# Altium project Kapitoshka.PrjPcb
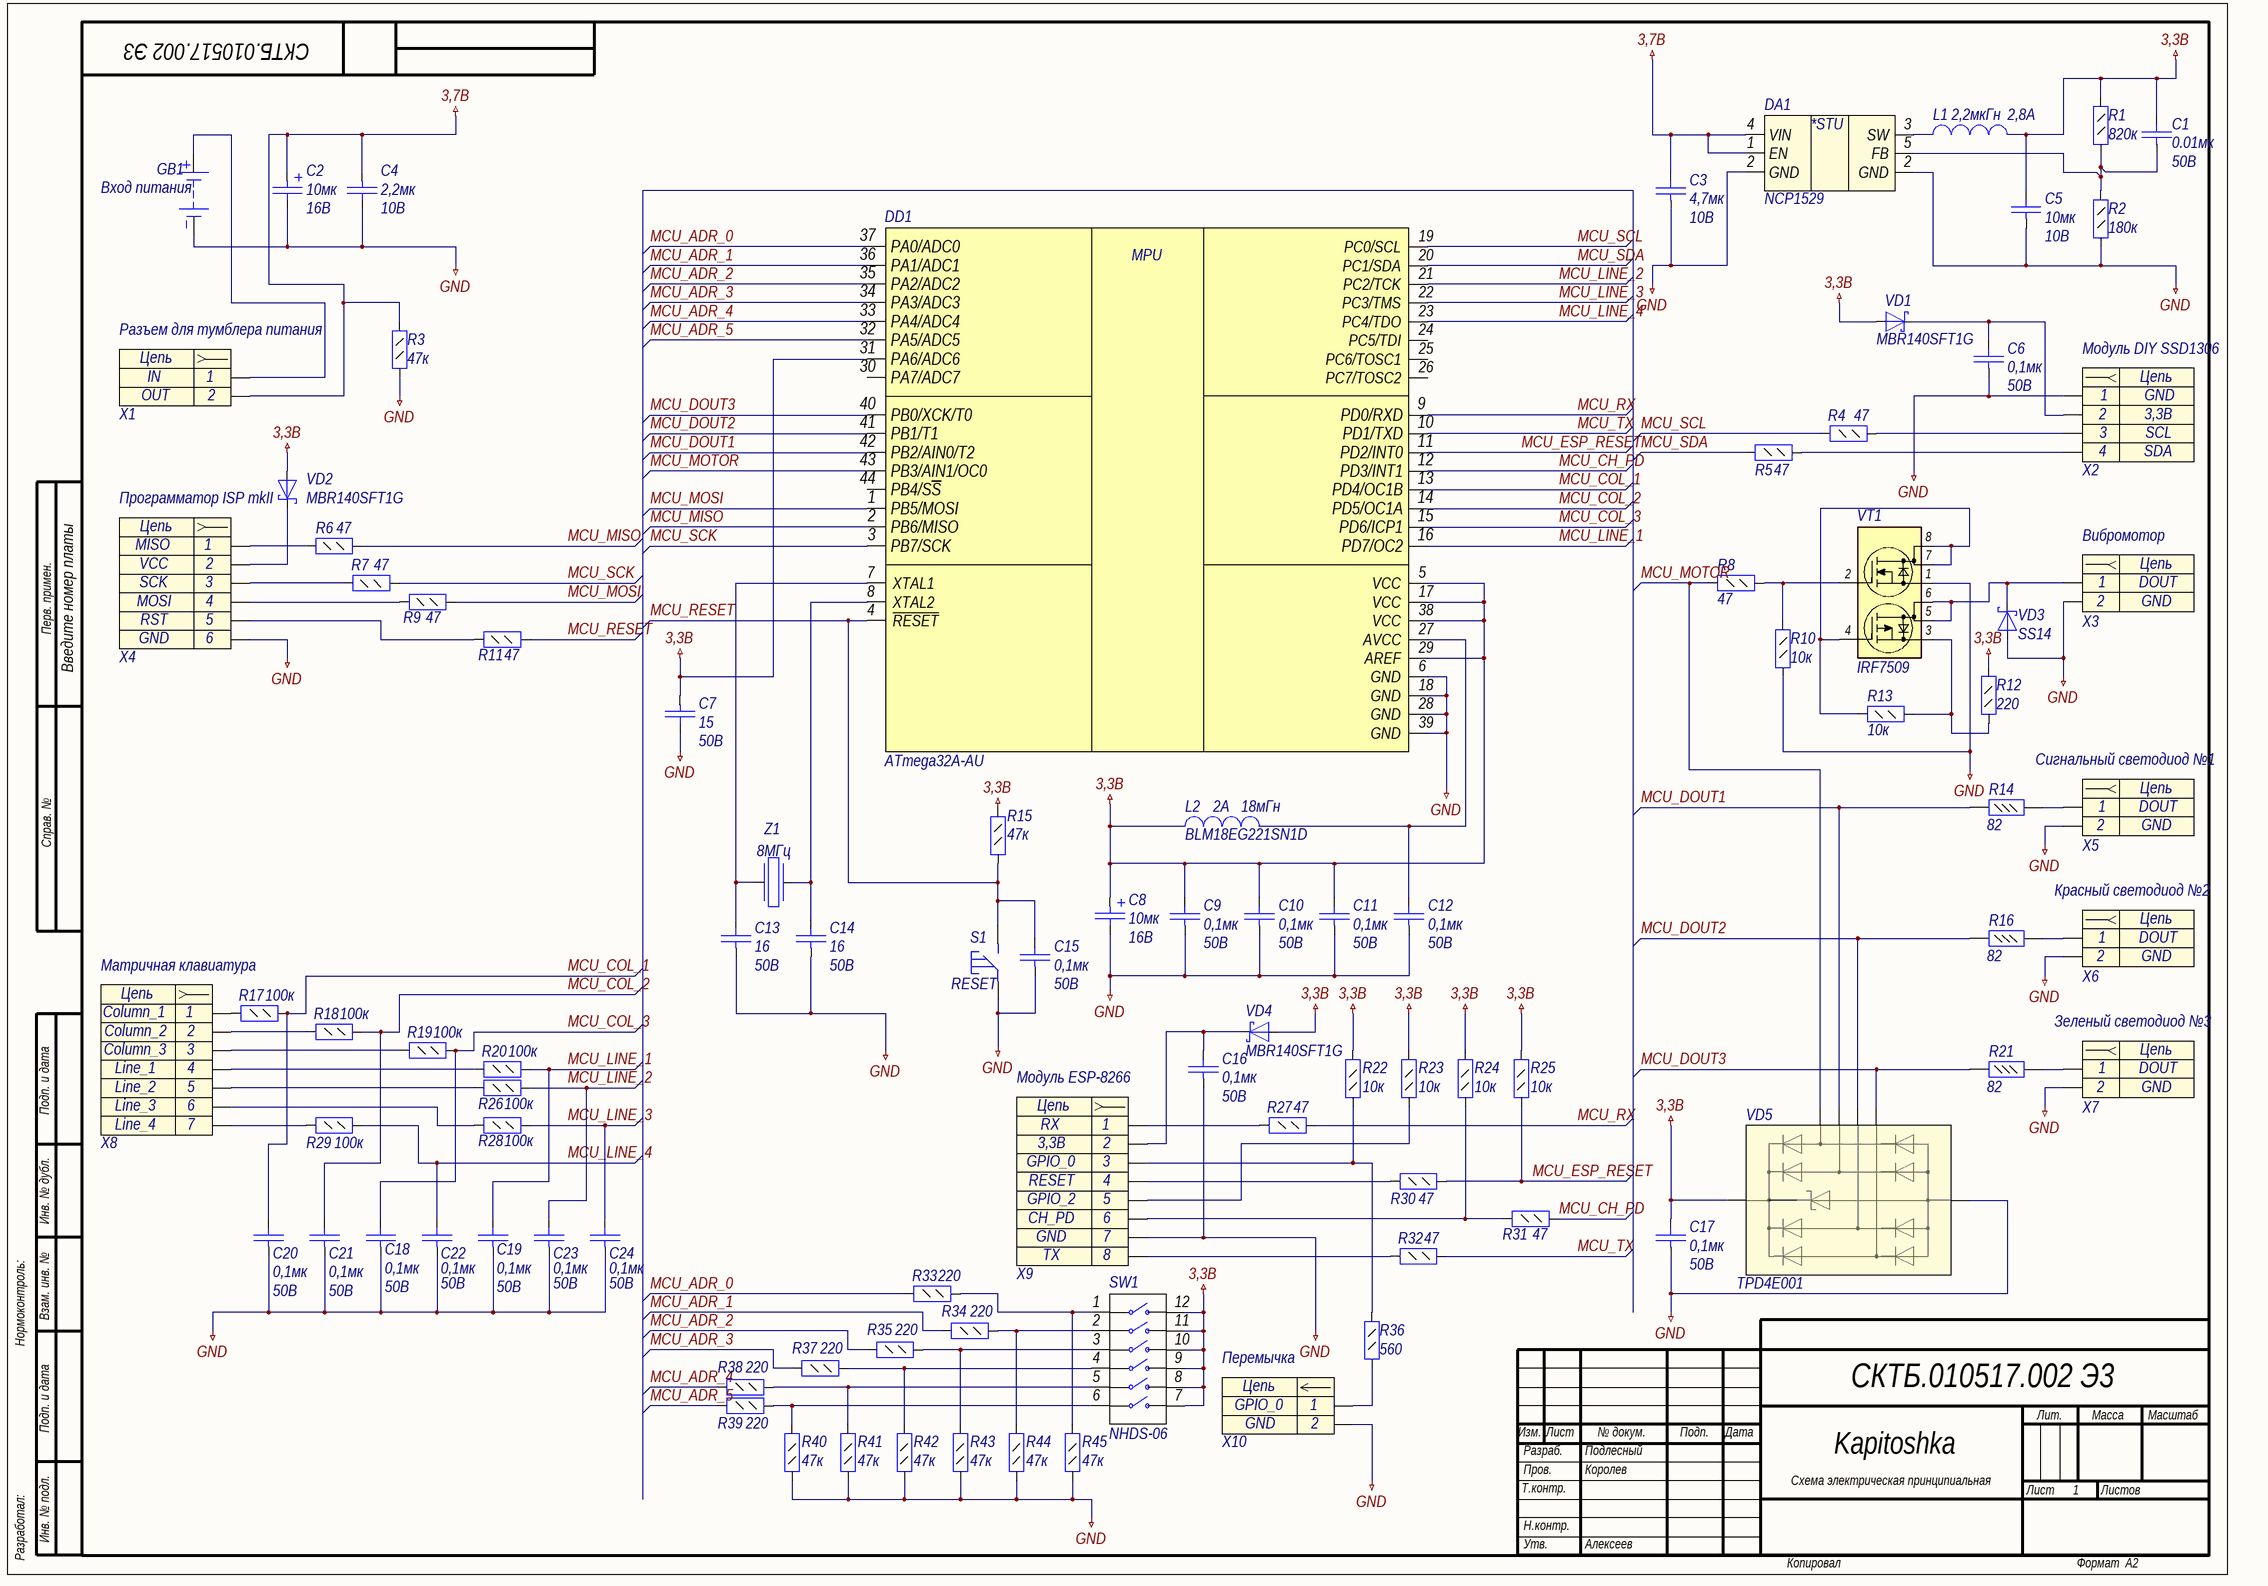
[diagram p0: Kapitoshka.SchDoc]
1 sheet, 93 parts. Net scope: global (net labels, ports and power ports of the same name join across sheets).
Board file: Kapitoshka.PcbDoc

## Sheet Kapitoshka.SchDoc: Kapitoshka
size 594 x 420 mm; ApprovedBy: Алексеев; CheckedBy: Королев; DrawnBy: Подлесный; DocumentNumber: СКТБ.010517.002 Э3; SheetNumber: 1; Format: A2; DocumentType: Схема электрическая принципиальная; ImagePath: Введите номер платы

### Parts
C1  0.01мк  Voltage: 50В  [C0603]
C2  Voltage: 16В  [3216 Case-A]  (hidden comment: 10мк)
C3  4,7мк  Voltage: 10В  [C0603]
C4  2,2мк  Voltage: 10В  [C0603]
C5  10мк  Voltage: 10В  [C0805]
C6  0,1мк  Voltage: 50В  [C0603]
C7  15  Voltage: 50В  [C0603]
C8  Voltage: 16В  [3216 Case-A]  (hidden comment: 10мк)
C9  0,1мк  Voltage: 50В  [C0603]
C10  0,1мк  Voltage: 50В  [C0603]
C11  0,1мк  Voltage: 50В  [C0603]
C12  0,1мк  Voltage: 50В  [C0603]
C13  16  Voltage: 50В  [C0805]
C14  16  Voltage: 50В  [C0805]
C15  0,1мк  Voltage: 50В  [C0603]
C16  0,1мк  Voltage: 50В  [C0603]
C17  0,1мк  Voltage: 50В  [C0603]
C18  0,1мк  Voltage: 50В  [C0603]
C19  0,1мк  Voltage: 50В  [C0603]
C20  0,1мк  Voltage: 50В  [C0603]
C21  0,1мк  Voltage: 50В  [C0603]
C22  0,1мк  Voltage: 50В  [C0603]
C23  0,1мк  Voltage: 50В  [C0603]
C24  0,1мк  Voltage: 50В  [C0603]
DA1  NCP1529  [TSOP-5]
DD1  ATmega32A-AU  [TQFP-44]
GB1  Вход питания  [KLS5-818-D]
L1  Imax: 2,8А  [SDR0604]  (hidden comment: 2,2мкГн)
L2  18мГн  Name: BLM18EG221SN1D  Imax: 2А  [L0603]
R1  820к  [R0603]
R2  180к  [R0603]
R3  47к  [R0603]
R4  47  [R0603]
R5  47  [R0603]
R6  47  [R0603]
R7  47  [R0603]
R8  47  [R0603]
R9  47  [R0603]
R10  10к  [R0603]
R11  47  [R0603]
R12  220  [R0603]
R13  10к  [R0603]
R14  82  [R0603]
R15  47к  [R0603]
R16  82  [R0603]
R17  100к  [R0603]
R18  100к  [R0603]
R19  100к  [R0603]
R20  100к  [R0603]
R21  82  [R0603]
R22  10к  [R0603]
R23  10к  [R0603]
R24  10к  [R0603]
R25  10к  [R0603]
R26  100к  [R0603]
R27  47  [R0603]
R28  100к  [R0603]
R29  100к  [R0603]
R30  47  [R0603]
R31  47  [R0603]
R32  47  [R0603]
R33  220  [R0603]
R34  220  [R0603]
R35  220  [R0603]
R36  560  [R0603]
R37  220  [R0603]
R38  220  [R0603]
R39  220  [R0603]
R40  47к  [R0603]
R41  47к  [R0603]
R42  47к  [R0603]
R43  47к  [R0603]
R44  47к  [R0603]
R45  47к  [R0603]
S1  RESET  [DTSM 32]
SW1  NHDS-06  [NHDS-06]
VD1  MBR140SFT1G  [SMA]
VD2  MBR140SFT1G  [SMA]
VD3  SS14  [SMA]
VD4  MBR140SFT1G  [SMA]
VD5  TPD4E001  [SOT23-6]
VT1  IRF7509  [Micro8]
X1  Разъем для тумблера питания  [2HOLE]
X2  Модуль DIY SSD1306  [OLED SSD1306]
X3  Вибромотор  [2HOLE]
X4  Программатор ISP mkII  [PLS2-6]
X5  Сигнальный светодиод №1  [2HOLE]
X6  Красный светодиод №2  [2HOLE]
X7  Зеленый светодиод №3  [2HOLE]
X8  Матричная клавиатура  [7HOLE]
X9  Модуль ESP-8266  [ESP8266]
X10  Перемычка  [PLS2-2]
Z1  8МГц  [QSMD3.2x5]

### Nets
3,3В: C1.2 C5.2 C7.1 C8.1 C9.2 C10.2 C11.2 C17.2 DD1.5(VCC) DD1.17(VCC) DD1.29(AREF) DD1.31(PA6/ADC6) DD1.38(VCC) L1.2 L2.1 R1.1 R12.2 R15.1 R22.2 R23.2 R24.2 R25.2 SW1.7 SW1.8 SW1.9 SW1.10 SW1.11 SW1.12 VD1.2(A) VD2.2(A) VD4.2(A) VD5.5(VCC)
3,7В: C2.1 C3.2 C4.1 DA1.1(EN) DA1.4(VIN) R3.1 X1.2
GND: C2.2 C3.1 C4.2 C5.1 C6.1 C7.2 C8.2 C9.1 C10.1 C11.1 C12.1 C13.1 C14.1 C15.1 C16.1 C17.1 C18.1 C19.1 C20.1 C21.1 C22.1 C23.1 C24.1 DA1.2(GND) DD1.6(GND) DD1.18(GND) DD1.28(GND) DD1.39(GND) GB1.2 R2.2 R3.2 R10.2 R40.1 R41.1 R42.1 R43.1 R44.1 R45.1 S1.1 VD3.2(A) VD5.2(GND) VT1.1(S1) X2.1 X3.2 X4.6 X5.2 X6.2 X7.2 X9.7 X10.2
MCU_ADR_0: DD1.37(PA0/ADC0) R33.2
MCU_ADR_1: DD1.36(PA1/ADC1) R34.2
MCU_ADR_2: DD1.35(PA2/ADC2) R35.2
MCU_ADR_3: DD1.34(PA3/ADC3) R37.2
MCU_ADR_4: DD1.33(PA4/ADC4) R38.2
MCU_ADR_5: DD1.32(PA5/ADC5) R39.2
MCU_CH_PD: DD1.12(PD3/INT1) R31.1
MCU_COL_1: C20.2 DD1.13(PD4/OC1B) R17.1
MCU_COL_2: C21.2 DD1.14(PD5/OC1A) R18.1
MCU_COL_3: C18.2 DD1.15(PD6/ICP1) R19.1
MCU_DOUT1: DD1.42(PB2/AIN0/T2) R14.1 VD5.3(IO2)
MCU_DOUT2: DD1.41(PB1/T1) R16.1 VD5.4(IO3)
MCU_DOUT3: DD1.40(PB0/XCK/T0) R21.1 VD5.6(IO4)
MCU_ESP_RESET: DD1.11(PD2/INT0) R25.1 R30.1
MCU_LINE_1: C19.2 DD1.16(PD7/OC2) R20.1
MCU_LINE_2: C23.2 DD1.21(PC2/TCK) R26.1
MCU_LINE_3: C24.2 DD1.22(PC3/TMS) R28.1
MCU_LINE_4: C22.2 DD1.23(PC4/TDO) R29.1
MCU_MISO: DD1.2(PB6/MISO) R6.2
MCU_MOSI: DD1.1(PB5/MOSI) R9.2
MCU_MOTOR: DD1.43(PB3/AIN1/OC0) R8.2 VD5.1(IO1)
MCU_RESET: C15.2 DD1.4(~{RESET}) R11.2 R15.2 S1.3
MCU_RX: DD1.9(PD0/RXD) R27.1
MCU_SCK: DD1.3(PB7/SCK) R7.2
MCU_SCL: DD1.19(PC0/SCL) R4.2
MCU_SDA: DD1.20(PC1/SDA) R5.2
MCU_TX: DD1.10(PD1/TXD) R32.1
NetC1_1: C1.1 DA1.5(FB) R1.2 R2.1
NetC6_2: C6.2 VD1.1(K) X2.2
NetC12_2: C12.2 DD1.27(AVCC) L2.2
NetC13_2: C13.2 DD1.7(XTAL1) Z1.2
NetC14_2: C14.2 DD1.8(XTAL2) Z1.1
NetC16_2: C16.2 VD4.1(K) X9.2
NetDA1_3: DA1.3(SW) L1.1
NetGB1_1: GB1.1 X1.1
NetR4_1: R4.1 X2.3
NetR5_1: R5.1 X2.4
NetR6_1: R6.1 X4.1
NetR7_1: R7.1 X4.3
NetR8_1: R8.1 R10.1 VT1.2(G1)
NetR9_1: R9.1 X4.4
NetR11_1: R11.1 X4.5
NetR12_1: R12.1 R13.2 VT1.3(S2)
NetR13_1: R13.1 VT1.4(G2) VT1.7(D1) VT1.8(D1)
NetR14_2: R14.2 X5.1
NetR16_2: R16.2 X6.1
NetR17_2: R17.2 X8.1
NetR18_2: R18.2 X8.2
NetR19_2: R19.2 X8.3
NetR20_2: R20.2 X8.4
NetR21_2: R21.2 X7.1
NetR22_1: R22.1 R36.1 X9.3
NetR23_1: R23.1 X9.5
NetR24_1: R24.1 R31.2 X9.6
NetR26_2: R26.2 X8.5
NetR27_2: R27.2 X9.1
NetR28_2: R28.2 X8.6
NetR29_2: R29.2 X8.7
NetR30_2: R30.2 X9.4
NetR32_2: R32.2 X9.8
NetR33_1: R33.1 R45.2 SW1.1
NetR34_1: R34.1 R44.2 SW1.2
NetR35_1: R35.1 R43.2 SW1.3
NetR36_2: R36.2 X10.1
NetR37_1: R37.1 R42.2 SW1.4
NetR38_1: R38.1 R41.2 SW1.5
NetR39_1: R39.1 R40.2 SW1.6
NetVD2_1: VD2.1(K) X4.2
NetVD3_1: VD3.1(K) VT1.5(D2) VT1.6(D2) X3.1

Not connected (* = marked no-connect by the designer): DD1 24(PC5/TDI) 25(PC6/TOSC1) 26(PC7/TOSC2) 30(PA7/ADC7) 44(PB4/S~{S})

### Notes on the sheet
- Перв. примен.
- Справ. №
- Подп. и дата
- Инв. № дубл.
- Нормоконтроль:
- Взам. инв. №
- Изм.
- Лист
- № докум.
- Подп.
- Дата
- Лит.
- Масса
- Масштаб
- Т.контр.
- Пров.
- Разраб.
- Листов
- Разработал:
- Инв. № подл.
- Н.контр.
- Утв.
- Копировал
- Формат
- (in symbol ATmega32A-AU) MPU
- (in symbol Header_2_plg) Цепь
- (in symbol Header_2_sct) Цепь
- (in symbol Header_4_sct) Цепь
- (in symbol Header_6_sct) Цепь
- (in symbol Header_7_sct_) Цепь
- (in symbol Header_8_sct) Цепь
- (in symbol NCP1529) *STU

### Library data of the parts
C1 C3-C7 C9-C24 = Capacitor: Конденсатор
  C1: Value: 0.01мк
  C3: Value: 4,7мк
  C4: Value: 2,2мк
  C5: Value: 10мк
  C6 C9-C12 C15-C24: Value: 0,1мк
  C7: Value: 15
  C13 C14: Value: 16
C2 C8 = Capacitor_pol: Конденсатор полярный; Value: 10мк
DA1 = NCP1529: Output Voltage Step-down  Converter
DD1 = ATmega32A-AU: Микроконтроллер 44-pin; Name: ATmega32A-AU
GB1 = Battery compartment: Value: *
L1 L2 = Inductor: Катушка индуктивности
  L1: Value: 2,2мкГн
  L2: Value: 18мГн
R1 R2 R4 R5 R8 R10 R12 R17-R20 R26-R39 = Resistor_0,125Вт: 0.125Вт 0805 47 Ом, 1%, Чип резистор (SMD)
  R1: Value: 820к
  R2: Value: 180к
  R4 R5 R8 R27 R30-R32: Value: 47
  R10: Value: 10к
  R12 R33-R35 R37-R39: Value: 220
  R17-R20 R26 R28 R29: Value: 100к
  R36: Value: 560
R3 R6 R7 R9 R11 R15 R22-R25 R40-R45 = Resistor_0,125Вт: Резистор
  R3 R15 R40-R45: Value: 47к
  R6 R7 R9 R11: Value: 47
  R22-R25: Value: 10к
R13 = Resistor_0,125Вт: 0.125Вт 0805 10 кОм, 1%, Чип резистор (SMD); Value: 10к
R14 R16 R21 = Resistor_0,05Вт: Резистор; Value: 82
S1 = Button_SMD: Кнопка; Name: RESET
SW1 = DS1040-06: DIP переключатель
VD1-VD4 = DiodeSchottky: Диод Шоттки
  VD1 VD2 VD4: Name: MBR140SFT1G
  VD3: Name: SS14
VD5 = TPD4E001: Диодная сборка; Manufacturer: Texas Instruments; Name: TPD4E001
VT1 = IRF7509: Комплементарная сборка МОП; Name: IRF7509
X1 = Header_2_sct: Разъем - 2 конт. розетка; Contact_1: IN; Contact_2: OUT; Name: Разъем для тумблера питания
X2 = Header_4_sct: Разъем - 4 конт. розетка; Contact_1: GND; Contact_2: 3,3В; Contact_3: SCL; Contact_4: SDA; Name: Модуль DIY SSD1306
X3 X5-X7 = Header_2_sct: Разъем - 2 конт. розетка; Contact_1: DOUT; Contact_2: GND
  X3: Name: Вибромотор
  X5: Name: Сигнальный светодиод №1
  X6: Name: Красный светодиод №2
  X7: Name: Зеленый светодиод №3
X4 = Header_6_sct: Разъем - 5 конт. розетка; Contact_1: MISO; Contact_2: VCC; Contact_3: SCK; Contact_4: MOSI; Contact_5: RST; Contact_6: GND; Name: Программатор ISP mkII
X8 = Header_7_sct_: Разъем - 5 конт. розетка; Contact_1: Column_1; Contact_2: Column_2; Contact_3: Column_3; Contact_4: Line_1; Contact_5: Line_2; Contact_7: Line_4; Contact_6: Line_3; Name: Матричная клавиатура
X9 = Header_8_sct: Разъем - 5 конт. розетка; Contact_1: RX; Contact_2: 3,3В; Contact_3: GPIO_0; Contact_4: RESET; Contact_5: GPIO_2; Contact_6: CH_PD; Contact_7: GND; Contact_8: TX; Name: Модуль ESP-8266
X10 = Header_2_plg: Разъем - 2 конт. вилка; Contact_1: GPIO_0; Contact_2: GND; Name: Перемычка
Z1 = Crystal: Кварцевый резонатор; Value: 8МГц